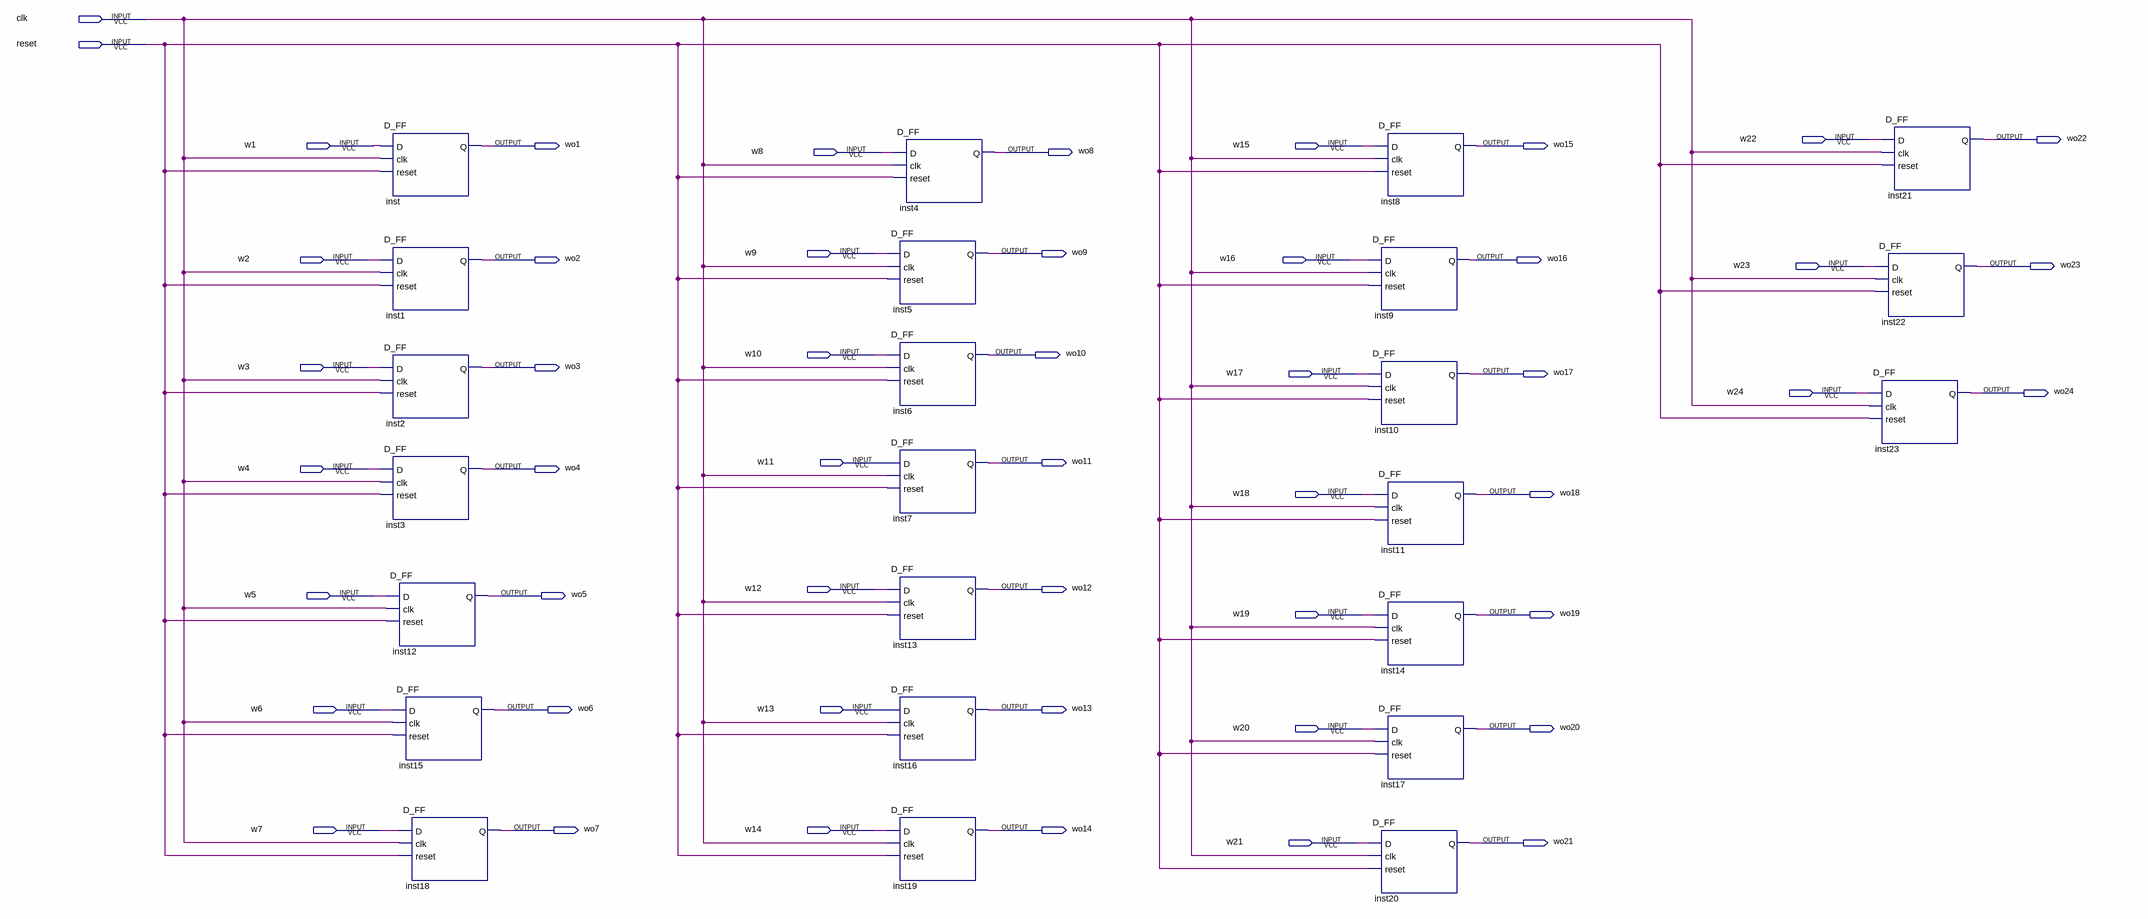
[diagram p0: schematic sheet]
// Quartus schematic Wall.bdf as structural Verilog: 24 symbols, 50 pins
module Wall (
  input  clk,
  input  reset,
  input  w22,
  input  w1,
  input  w15,
  input  w8,
  input  w9,
  input  w2,
  input  w16,
  input  w23,
  input  w10,
  input  w3,
  input  w17,
  input  w24,
  input  w11,
  input  w4,
  input  w18,
  input  w12,
  input  w5,
  input  w19,
  input  w6,
  input  w13,
  input  w20,
  input  w7,
  input  w14,
  input  w21,
  output wo22,
  output wo1,
  output wo15,
  output wo8,
  output wo9,
  output wo2,
  output wo16,
  output wo23,
  output wo10,
  output wo3,
  output wo17,
  output wo24,
  output wo11,
  output wo4,
  output wo18,
  output wo12,
  output wo5,
  output wo19,
  output wo6,
  output wo13,
  output wo20,
  output wo7,
  output wo14,
  output wo21
);

  D_FF inst (.D(w1), .clk(clk), .reset(reset), .Q(wo1));
  D_FF inst1 (.D(w2), .clk(clk), .reset(reset), .Q(wo2));
  D_FF inst2 (.D(w3), .clk(clk), .reset(reset), .Q(wo3));
  D_FF inst3 (.D(w4), .clk(clk), .reset(reset), .Q(wo4));
  D_FF inst12 (.D(w5), .clk(clk), .reset(reset), .Q(wo5));
  D_FF inst15 (.D(w6), .clk(clk), .reset(reset), .Q(wo6));
  D_FF inst18 (.D(w7), .clk(clk), .reset(reset), .Q(wo7));
  D_FF inst4 (.D(w8), .clk(clk), .reset(reset), .Q(wo8));
  D_FF inst5 (.D(w9), .clk(clk), .reset(reset), .Q(wo9));
  D_FF inst6 (.D(w10), .clk(clk), .reset(reset), .Q(wo10));
  D_FF inst7 (.D(w11), .clk(clk), .reset(reset), .Q(wo11));
  D_FF inst13 (.D(w12), .clk(clk), .reset(reset), .Q(wo12));
  D_FF inst16 (.D(w13), .clk(clk), .reset(reset), .Q(wo13));
  D_FF inst19 (.D(w14), .clk(clk), .reset(reset), .Q(wo14));
  D_FF inst8 (.D(w15), .clk(clk), .reset(reset), .Q(wo15));
  D_FF inst9 (.D(w16), .clk(clk), .reset(reset), .Q(wo16));
  D_FF inst10 (.D(w17), .clk(clk), .reset(reset), .Q(wo17));
  D_FF inst11 (.D(w18), .clk(clk), .reset(reset), .Q(wo18));
  D_FF inst14 (.D(w19), .clk(clk), .reset(reset), .Q(wo19));
  D_FF inst17 (.D(w20), .clk(clk), .reset(reset), .Q(wo20));
  D_FF inst20 (.D(w21), .clk(clk), .reset(reset), .Q(wo21));
  D_FF inst21 (.D(w22), .clk(clk), .reset(reset), .Q(wo22));
  D_FF inst22 (.D(w23), .clk(clk), .reset(reset), .Q(wo23));
  D_FF inst23 (.D(w24), .clk(clk), .reset(reset), .Q(wo24));
endmodule
